# Altium schematic sheet NRF52840.SchDoc
size A3; SheetNumber: 6; SheetTotal: 6
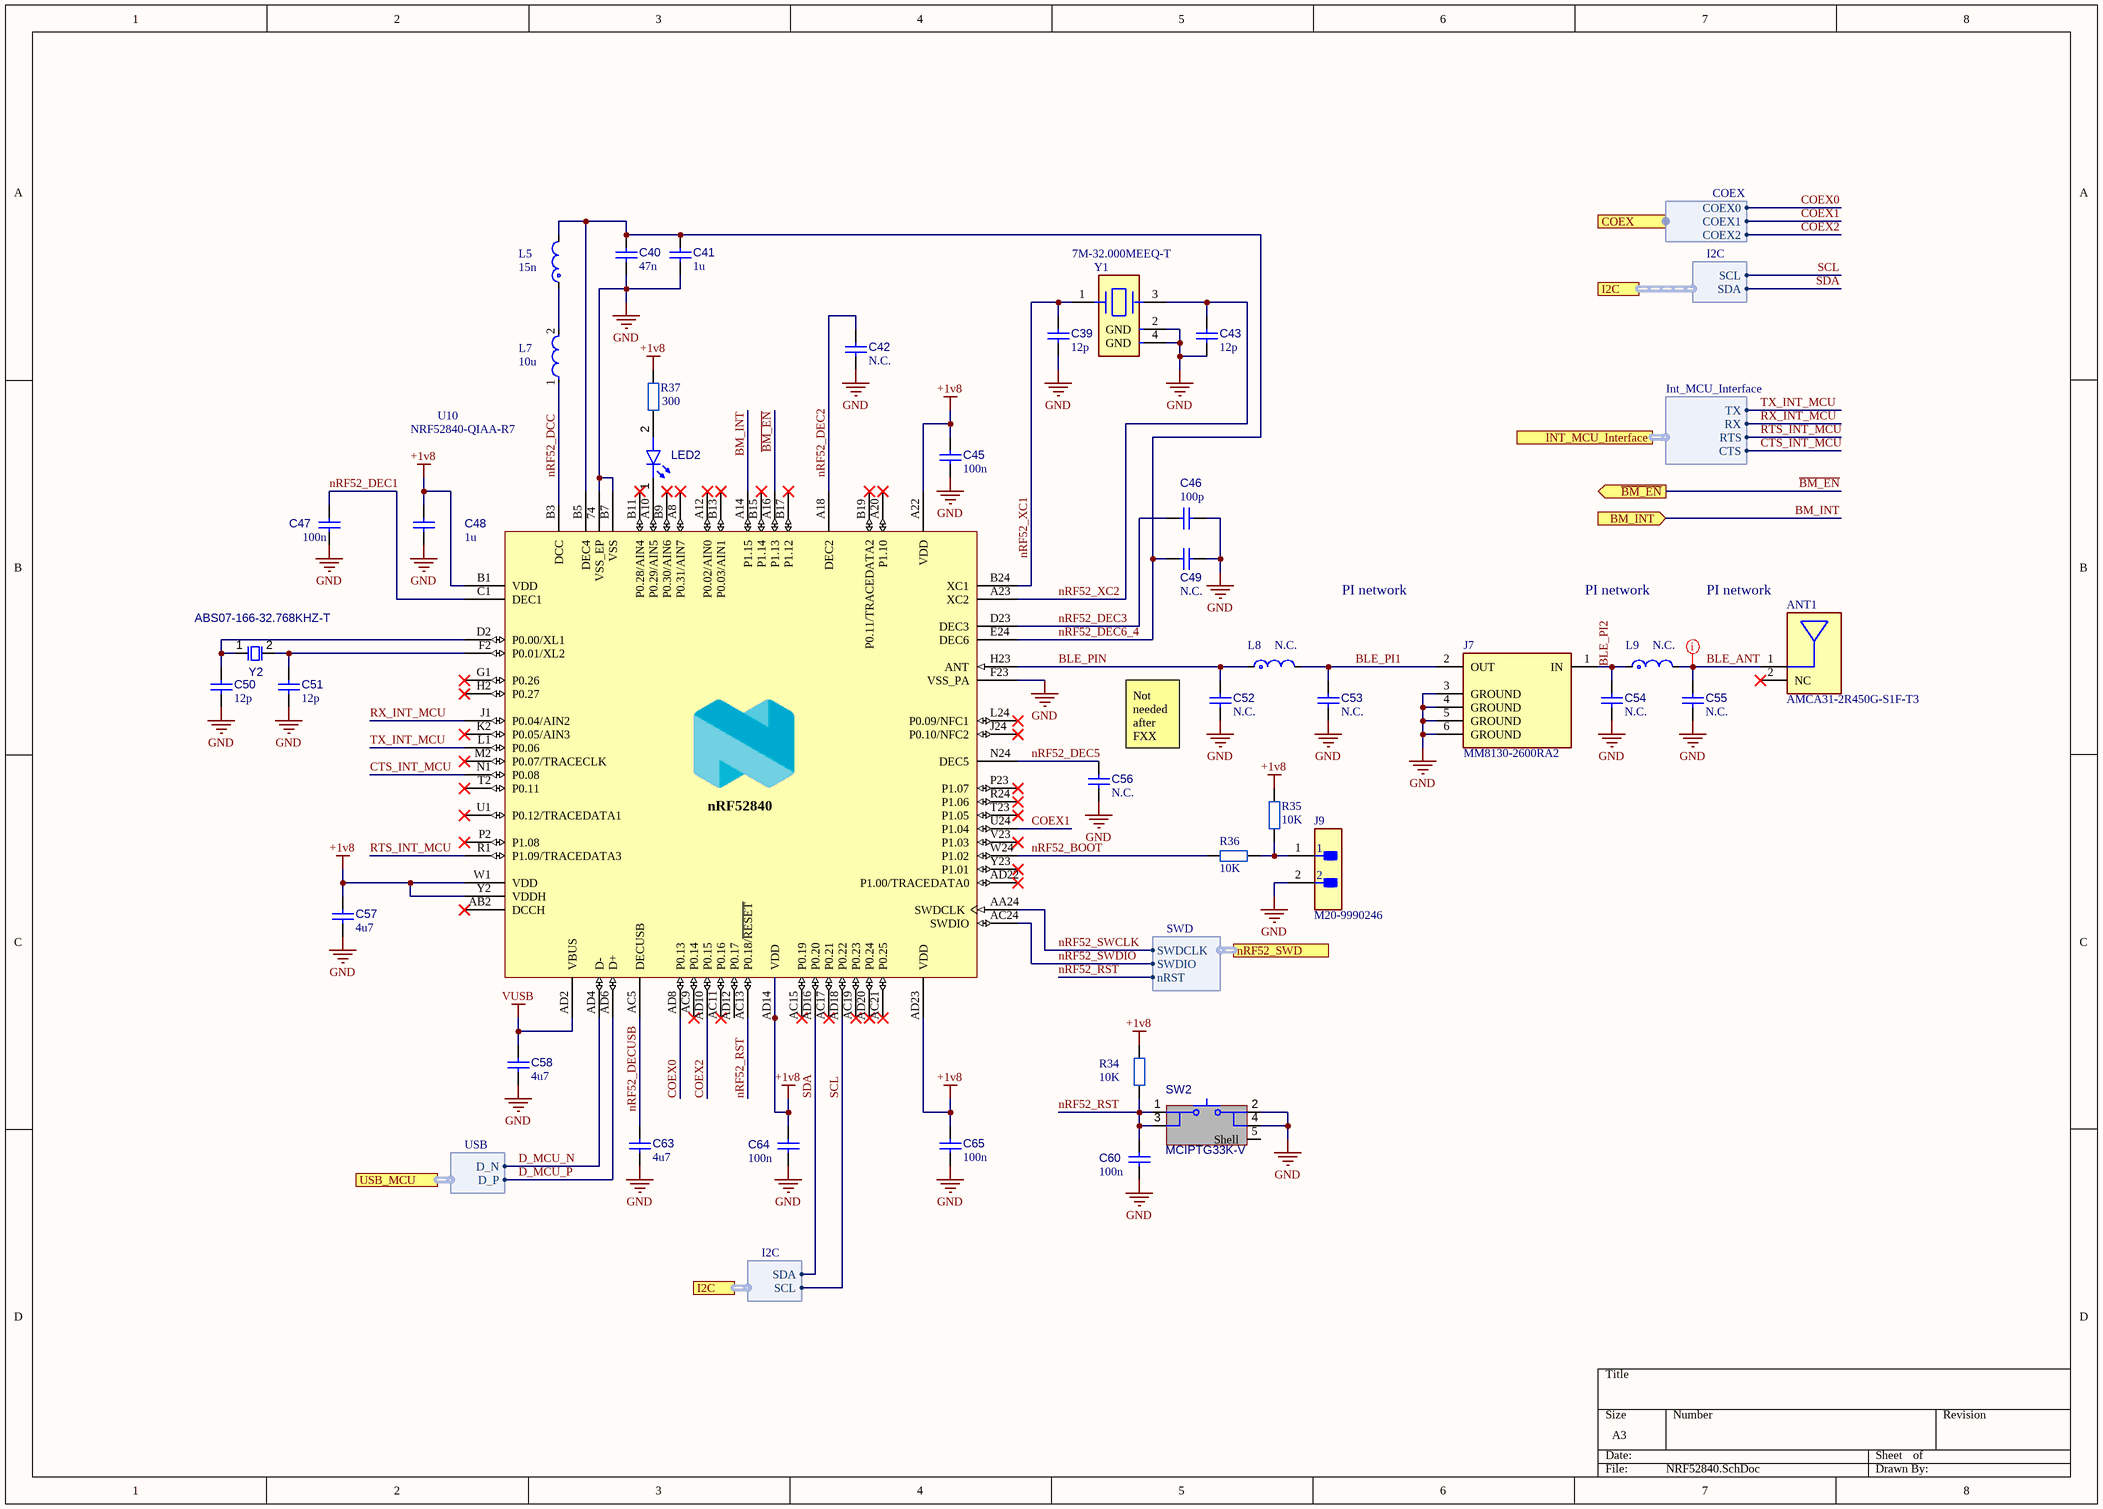
[diagram p0: NRF52840.SchDoc]

## Parts
ANT1  AMCA31-2R450G-S1F-T3  [FP-AMCA31-MFG]
C39  value 12p  [CAPC1005X55X25LL05T10 HD]  (hidden comment: Capacitor 0402)
C40  value 47n  [CAPC1005X55X25LL05T10 HD]  (hidden comment: Capacitor 0402)
C41  value 1u  [CAPC1005X55X25LL05T10 HD]  (hidden comment: Capacitor 0402)
C42  value N.C.  [CAPC1005X55X25LL05T10 HD]  (hidden comment: Capacitor 0402)
C43  value 12p  [CAPC1005X55X25LL05T10 HD]  (hidden comment: Capacitor 0402)
C45  value 100n  [CAPC1005X55X25LL05T10 HD]  (hidden comment: Capacitor 0402)
C46  value 100p  [CAPC1005X55X25LL05T10 HD]  (hidden comment: Capacitor 0402)
C47  value 100n  [CAPC1005X55X25LL05T10 HD]  (hidden comment: Capacitor 0402)
C48  value 1u  [CAPC1005X55X25LL05T10 HD]  (hidden comment: Capacitor 0402)
C49  value N.C.  [CAPC1005X55X25LL05T10 HD]  (hidden comment: Capacitor 0402)
C50  value 12p  [CAPC1005X55X25LL05T10 HD]  (hidden comment: Capacitor 0402)
C51  value 12p  [CAPC1005X55X25LL05T10 HD]  (hidden comment: Capacitor 0402)
C52  value N.C.  [CAPC1005X55X25LL05T10 HD]  (hidden comment: Capacitor 0402)
C53  value N.C.  [CAPC1005X55X25LL05T10 HD]  (hidden comment: Capacitor 0402)
C54  value N.C.  [CAPC1005X55X25LL05T10 HD]  (hidden comment: Capacitor 0402)
C55  value N.C.  [CAPC1005X55X25LL05T10 HD]  (hidden comment: Capacitor 0402)
C56  value N.C.  [CAPC1005X55X25LL05T10 HD]  (hidden comment: Capacitor 0402)
C57  value 4u7  [CAPC1005X55X25LL05T10 HD]  (hidden comment: Capacitor 0402)
C58  value 4u7  [CAPC1005X55X25LL05T10 HD]  (hidden comment: Capacitor 0402)
C60  value 100n  [CAPC1005X55X25LL05T10 HD]  (hidden comment: Capacitor 0402)
C63  value 4u7  [CAPC1005X55X25LL05T10 HD]  (hidden comment: Capacitor 0402)
C64  value 100n  [CAPC1005X55X25LL05T10 HD]  (hidden comment: Capacitor 0402)
C65  value 100n  [CAPC1005X55X25LL05T10 HD]  (hidden comment: Capacitor 0402)
J7  MM8130-2600RA2  [FP-MM8130-2600RA2-MFG]
J9  M20-9990246  [FP-M20-9990246-MFG]
L5  value 15n  [INDC1005X55X25LL05T10_A]  (hidden comment: Inductor 0402)
L7  value 10u  [FP-LQM18DN_70-MFG]  (hidden comment: Inductor 0603)
L8  value N.C.  [INDC1005X55X25LL05T10_A]  (hidden comment: Inductor 0402)
L9  value N.C.  [INDC1005X55X25LL05T10_A]  (hidden comment: Inductor 0402)
LED2  QBLP595-R  [QTB-QBLP595_V]  (value not drawn)
R34  value 10K  [RESC1005X40X25LL10T10 HD]  (hidden comment: Resistor 0403)
R35  value 10K  [RESC1005X40X25LL10T10 HD]  (hidden comment: Resistor 0403)
R36  value 10K  [RESC1005X40X25LL10T10 HD]  (hidden comment: Resistor 0403)
R37  value 300  [RESC1005X40X25LL10T10 HD]  (hidden comment: Resistor 0403)
SW2  MCIPTG33K-V  [MCIPTG33K-V-Footprint-1]
U10  NRF52840-QIAA-R7  [NRSC-AQFN-73]
Y1  7M-32.000MEEQ-T  [FP-7M-MFG]
Y2  ABS07-166-32.768KHZ-T  [EPSON-FC-135_V]

## Ports
BM_INT (in), COEX (harness COEX), I2C (harness I2C), INT_MCU_Interface (harness Int_MCU_Interface), nRF52_SWD (harness SWD), USB_MCU (harness USB), ~{BM_EN} (out)

## Harnesses
SWD: nRST, SWDCLK, SWDIO
USB: D_N, D_P
COEX: COEX2, COEX1, COEX0
I2C: SCL, SDA
I2C: SDA, SCL
Int_MCU_Interface: TX, RX, RTS, CTS

## Nets
+1v8: C45.2 C48.2 C57.2 C64.2 C65.2 R34.2 R35.1 R37.1 U10.A22(VDD) U10.AD14(VDD) U10.AD23(VDD) U10.B1(VDD) U10.W1(VDD) U10.Y2(VDDH)
GND: C39.1 C40.1 C41.1 C42.1 C43.1 C45.1 C46.1 C47.1 C48.1 C49.1 C50.1 C51.1 C52.1 C53.1 C54.1 C55.1 C56.1 C57.1 C58.1 C60.1 C63.1 C64.1 C65.1 J7.3(GROUND) J7.4(GROUND) J7.5(GROUND) J7.6(GROUND) J9.2 SW2.2 SW2.4 U10.74(VSS_EP) U10.B7(VSS) U10.F23(VSS_PA) Y1.2(GND) Y1.4(GND)
VUSB: C58.2 U10.AD2(VBUS)
~{BM_EN}: U10.A16(P1.13) ; port ~{BM_EN}
BLE_ANT: ANT1.1(Feed_Point) C55.2 L9.2
BLE_PI1: C53.2 J7.2(OUT) L8.2
BLE_PI2: C54.2 J7.1(IN) L9.1
BLE_PIN: C52.2 L8.1 U10.H23(ANT)
BM_INT: U10.A14(P1.15) ; port BM_INT
COEX0: U10.AD8(P0.13) ; port COEX.COEX0
COEX1: U10.U24(P1.04) ; port COEX.COEX1
COEX2: U10.AD10(P0.15) ; port COEX.COEX2
CTS_INT_MCU: U10.N1(P0.08) ; port INT_MCU_Interface.CTS
D_MCU_N: U10.AD4(D-) ; port USB_MCU.D_N
D_MCU_P: U10.AD6(D+) ; port USB_MCU.D_P
nRF52_BOOT: R36.2 U10.W24(P1.02)
nRF52_DCC: L7.1 U10.B3(DCC)
nRF52_DEC1: C47.2 U10.C1(DEC1)
nRF52_DEC2: C42.2 U10.A18(DEC2)
nRF52_DEC3: C46.2 U10.D23(DEC3)
nRF52_DEC5: C56.2 U10.N24(DEC5)
nRF52_DEC6_4: C40.2 C41.2 C49.2 L5.2 U10.B5(DEC4) U10.E24(DEC6)
nRF52_DECUSB: C63.2 U10.AC5(DECUSB)
nRF52_RST: C60.2 R34.1 SW2.1 SW2.3 U10.AC13(P0.18/~{RESET}) ; port nRF52_SWD.nRST
nRF52_SWCLK: U10.AA24(SWDCLK) ; port nRF52_SWD.SWDCLK
nRF52_SWDIO: U10.AC24(SWDIO) ; port nRF52_SWD.SWDIO
nRF52_XC1: C39.2 U10.B24(XC1) Y1.1
nRF52_XC2: C43.2 U10.A23(XC2) Y1.3
RTS_INT_MCU: U10.R1(P1.09/TRACEDATA3) ; port INT_MCU_Interface.RTS
RX_INT_MCU: U10.J1(P0.04/AIN2) ; port INT_MCU_Interface.RX
SCL: U10.AD18(P0.22) ; port I2C.SCL
SDA: U10.AD16(P0.20) ; port I2C.SDA
TX_INT_MCU: U10.L1(P0.06) ; port INT_MCU_Interface.TX
NetC50_2: C50.2 U10.D2(P0.00/XL1) Y2.1
NetC51_2: C51.2 U10.F2(P0.01/XL2) Y2.2
NetJ9_1: J9.1 R35.2 R36.1
NetL5_1: L5.1 L7.2
NetLED2_1: LED2.1(K) U10.A10(P0.29/AIN5)
NetLED2_2: LED2.2(A) R37.2

Not connected (* = marked no-connect by the designer): ANT1 2(NC)*; SW2 5(Shell); U10 A8(P0.31/AIN7)* A12(P0.02/AIN0)* A20(P1.10)* AB2(DCCH)* AC9(P0.14)* AC11(P0.16)* AC15(P0.19)* AC17(P0.21)* AC19(P0.23)* AC21(P0.25)* AD12(P0.17) AD20(P0.24)* AD22(P1.00/TRACEDATA0)* B9(P0.30/AIN6)* B11(P0.28/AIN4)* B13(P0.03/AIN1)* B15(P1.14)* B17(P1.12)* B19(P0.11/TRACEDATA2)* G1(P0.26)* H2(P0.27)* J24(P0.10/NFC2)* K2(P0.05/AIN3)* L24(P0.09/NFC1)* M2(P0.07/TRACECLK)* P2(P1.08)* P23(P1.07)* R24(P1.06)* T2(P0.11)* T23(P1.05)* U1(P0.12/TRACEDATA1)* V23(P1.03)* Y23(P1.01)*

## Layout directives
net class RF: BLE_ANT

## Notes on the sheet
- PI network
- Not needed after FXX
- (in symbol CMP-020-00024-2) nRF52840

## Library data of the parts
ANT1 = CMP-27836-000002-1: RF ANT 2.4GHZ CHIP SOLDER SMD; Manufacturer: Abracon; Power Rating: 3W; Max Frequency: 2450MHz; Impedance: 50Ω; Number Of Bands: 1; Bandwidth: 100MHz; RoHS: TRUE; ComponentLink2Description: Datasheet; Category: Ant; Temperature: -40°C to +85°C; Device Class L3: RF Antennas; Octopart: https://octopart.com/amca31-2r450g-s1f-t3-abracon-31435383; Manufacturer Part Number: AMCA31-2R450G-S1F-T3; Digikey Description: RF ANT 2.4GHZ CHIP SOLDER SMD; Package: AMCA31; Temperature Range High: +85°C; Automotive: No; Device Class L2: RF Semiconductors and Devices; ComponentLink2URL: https://abracon.com/chip-antenna/AMCA31-2R450G-S1F-T3.pdf; Temperature Range Low: -40°C; Device Class L1: Integrated Circuits (ICs); Lead Free: Yes; Height: 1.4mm; Mouser Description: Antennas 2.45GHz BW 90dB + Gain -1 dBi avg.
C39 C43 = CMP-001-00008-14: Chip Capacitor, 0402 (1005 Metric); Voltage Rating: ?V; Capacitor Type: Ceramic; Tolerance: ?%; Case/Package: 0402; Mounting Technology: SMT; Pins: 2
C40-C42 C45-C58 C60 C63-C65 = CMP-001-00008-14: Chip Capacitor, 0402 (1005 Metric); Tolerance: ?%; Capacitor Type: Ceramic; Voltage Rating: ?V; Case/Package: 0402; Pins: 2; Mounting Technology: SMT
J7 = CMP-000011-2: CONN SWF JACK STR 50 OHM SMD
J9 = CMP-15831-000009-1: CONN HEADER VERT 2POS 2.54MM; Manufacturer: Harwin; Conn Gender: Male; Conn Orientation: Vertical; Number Of Contacts: 2; Current Rating: 3A; ComponentLink2URL: https://cdn.harwin.com/pdfs/M20-999.pdf; ComponentLink2Description: Datasheet; Package: M20-9990246; Temperature: -40°C to +105°C; Octopart: https://octopart.com/m20-9990246-harwin-2590635; Mouser Description: 2.54mm (0.1") Pitch SIL Vertical PC Tail Pin Header, 6.1mm mating pin height, tin, 2 contacts; Temperature Range High: +105°C; Device Class L1: Connectors; RoHS: TRUE; Automotive: No; Height: 8.99mm; Number Of Rows: 1; Contact Material: Tin,Nickel; Category: Conn; Pitch: 2.54mm; Lead Free: Yes; Digikey Description: CONN HEADER VERT 2POS 2.54MM; Manufacturer Part Number: M20-9990246; Temperature Range Low: -40°C; Device Class L3: unset; Device Class L2: Headers and Wire Housings
L5 L8 L9 = CMP-000000-6: Inductor RF Chip Thin Film 0402; Current Rating: ?A; Resonant Frequency: ?Hz; Pins: 2
  L5: Inductance: 15n
  L8 L9: Inductance: N.C.
L7 = CMP-000001-5: Inductor 0603 Multilayer; Current Rating: ?A; Voltage Rating: ?V; Package: 0603
LED2 = CMP-007-00040-3: Chip LED 0402, Red, 0.02 A, 2.0 to 2.5 V, -40 to 80 degC, 2-Pin SMD, RoHS, Tape and Reel; Colour: Red; RoHS Compliant: Yes; Case/Package: 0402; Pins: 2; Mounting Technology: SMT
R34-R37 = CMP-009-00178-4: Package: 0403; Design Item ID: Resistor EU; Source: Moto Symbol Lib.SchLib
SW2 = CMP-011-00014-2: The MCIPTG33K-V is a Tactile Switch with solder terminal. The 2.8 x 3.8mm vertical push series switch has silver plated stainless steel contact, high-temperature thermoplastic LCP stem and silver plated stainless steel cover.; ComponentLink1URL: https://www.farnell.com/datasheets/3167256.pdf; ComponentLink1Description: Link
U10 = CMP-020-00024-2: Advanced multi-protocol SoC supporting Bluetooth 5/ANT/ 802.15.4/ 2.4GHz proprietary
Y1 = CMP-003-00030-1: Crystal 32MHz ±10ppm (Tol) ±10ppm (Stability) 10pF FUND 50Ohm 4-Pin SMD T/R
Y2 = CMP-003-00029-1: Crystal 32.768kHz 10ppm 7pF -40C +85C; Pins: 2; Frequency: 32.768kHz